# EAGLE schematic ultrasonic (EAGLE 4.15)
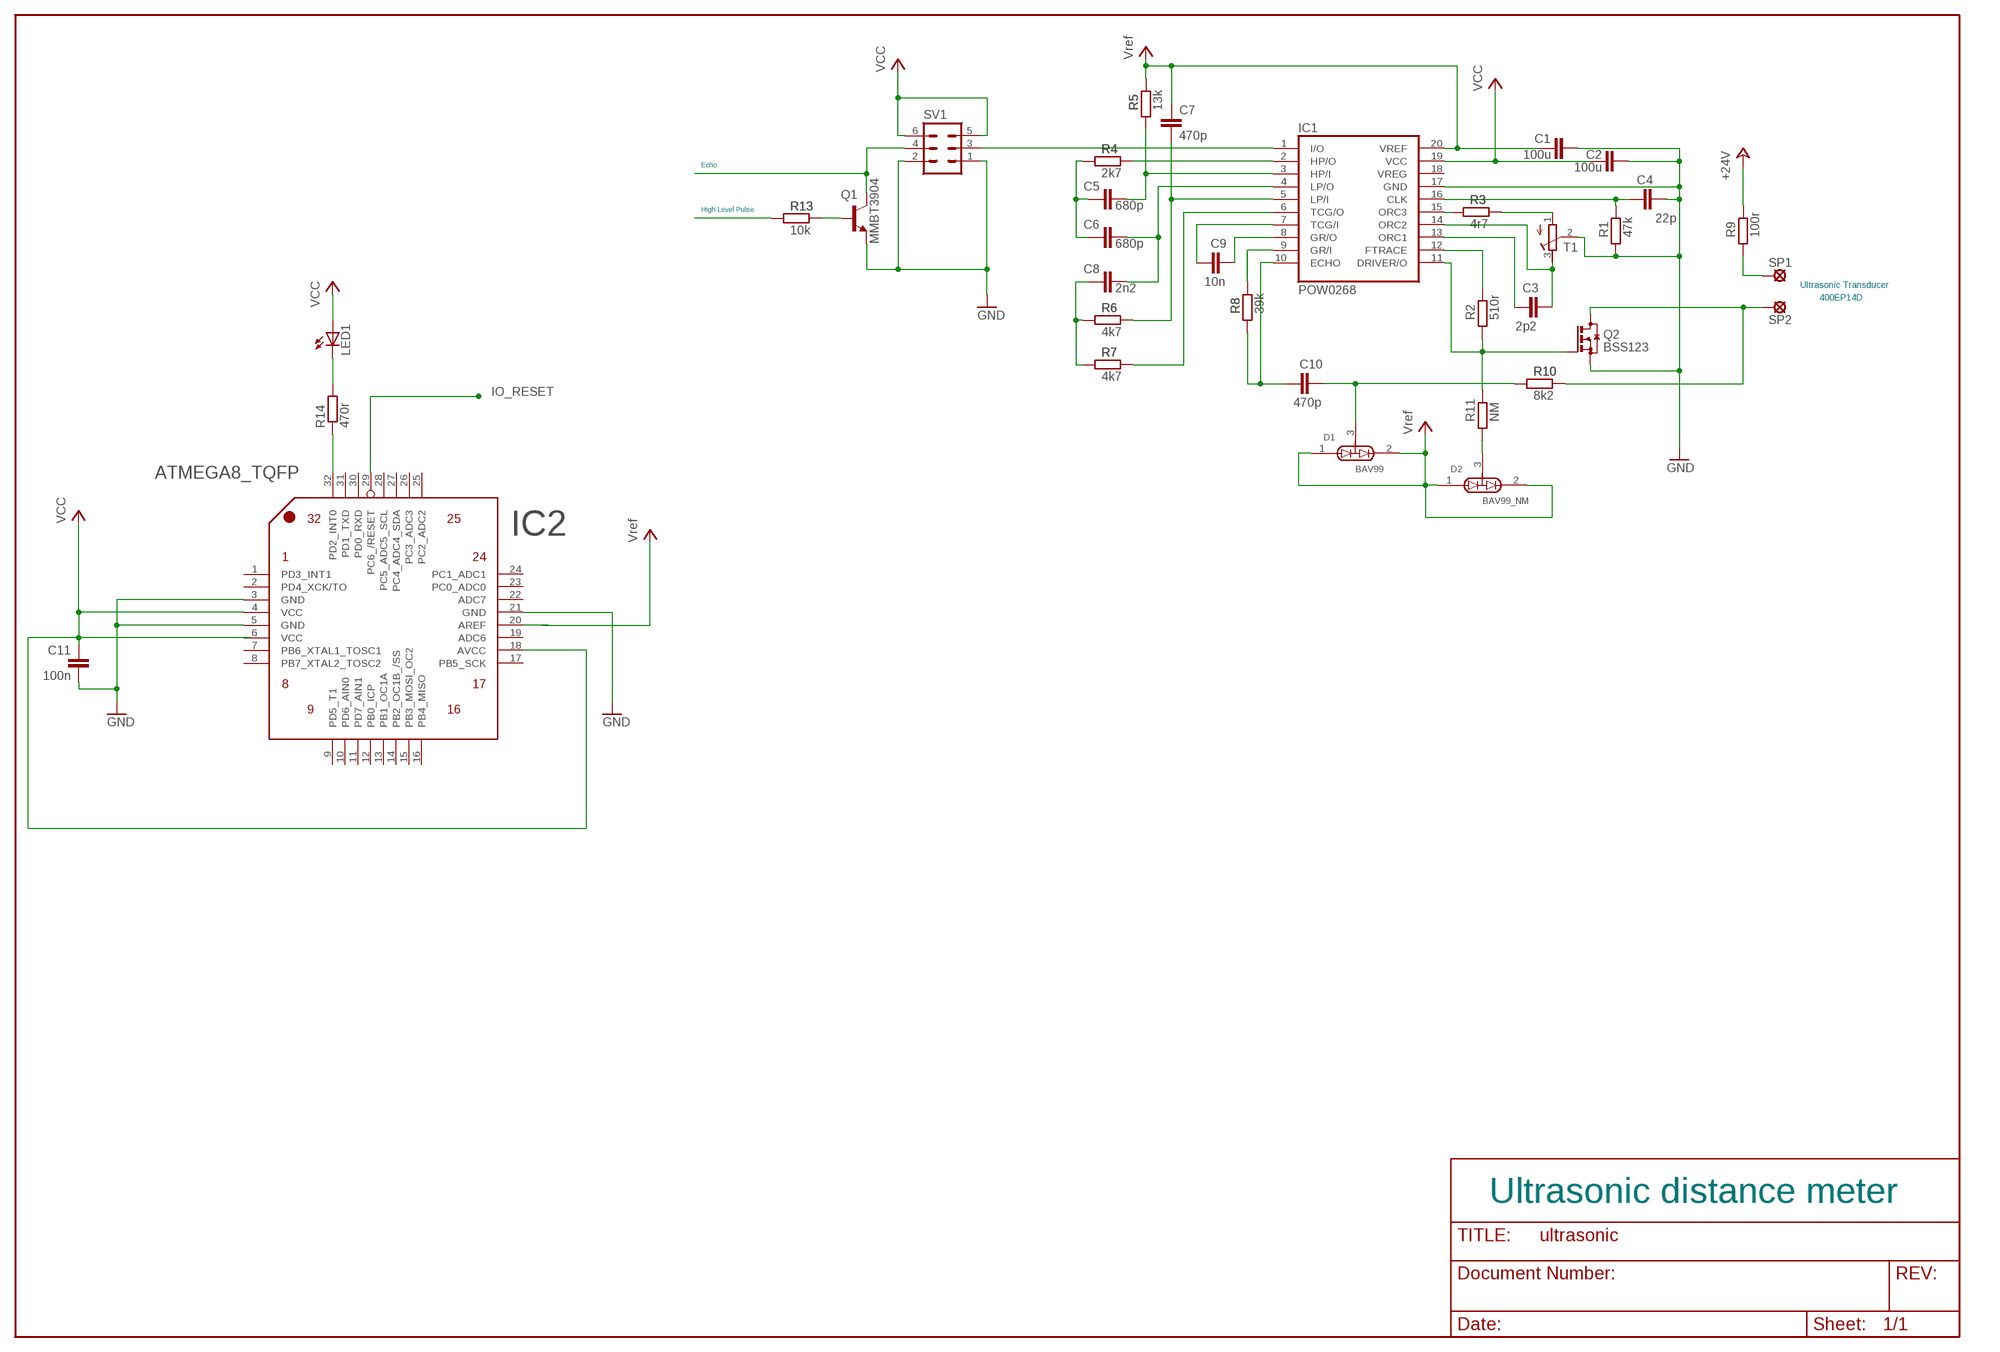
[diagram p0: schematic, sheet 1]

## Parts
C1  100u  C-EUC0805K  [C0805K]
C2  100u  C-EUC0805K  [C0805K]
C3  2p2  C-EUC0805K  [C0805K]
C4  22p  C-EUC0805K  [C0805K]
C5  680p  C-EUC0805K  [C0805K]
C6  680p  C-EUC0805K  [C0805K]
C7  470p  C-EUC0805K  [C0805K]
C8  2n2  C-EUC0805K  [C0805K]
C9  10n  C-EUC0805K  [C0805K]
C10  470p  C-EUC0805K  [C0805K]
C11  100n  C-EUC0805K  [C0805K]
D1  BAV99  [SOT23]
D2  BAV99_NM  BAV99  [SOT23]
IC1  POW0268  [SSOP20BU]
IC2  ATMEGA8_TQFP  [TQFP-32]
LED1  LEDCHIPLED_1206  [CHIPLED_1206]
Q1  MMBT3904  MMBT3904LT1-NPN-SOT23-BEC  [SOT23-BEC]
Q2  BSS123  [SOT23]
R1  47k  R-EU_R0805W  [R0805W]
R2  510r  R-EU_R0805W  [R0805W]
R3  4r7  R-EU_R0805W  [R0805W]
R4  2k7  R-EU_R0805W  [R0805W]
R5  13k  R-EU_R0805W  [R0805W]
R6  4k7  R-EU_R0805W  [R0805W]
R7  4k7  R-EU_R0805W  [R0805W]
R8  39k  R-EU_R0805W  [R0805W]
R9  100r  R-EU_R0805W  [R0805W]
R10  8k2  R-EU_R0805W  [R0805W]
R11  NM  R-EU_R0805W  [R0805W]
R13  10k  R-EU_R0805W  [R0805W]
R14  470r  R-EU_R0805W  [R0805W]
SP1  LSP10  [LSP10]
SP2  LSP10  [LSP10]
SV1  MA03-2  [MA03-2]
T1  R-TRIMM64W  [RTRIM64W]

## Nets
0V: C11.1 Q1.E SV1.1 SV1.2 ; supply symbol labelled GND
+3V3: LED1.A ; supply symbol labelled VCC
+24V: R9.2
GND: C1.2 C2.2 C4.1 IC1.17(GND) Q2.2(S) R1.1 T1.2(S)
IO_RESET: IC2.29(PC6_/RESET)
N$1: IC1.15(ORC3) R3.1
N$2: R3.2 T1.1(E)
N$3: C3.2 IC1.13(ORC1)
N$4: C4.2 IC1.16(CLK) R1.2
N$5: IC1.12(FTRACE) R2.2
N$6: D2.3 R11.1
N$7: IC1.11(DRIVER/O) Q2.1(G) R2.1 R11.2
N$8: Q2.3(D) R10.2 SP2.MP
N$9: IC1.1(I/O) SV1.3
N$10: IC1.2(HP/O) R4.2
N$11: C5.1 IC1.3(HP/I) R5.1
N$12: C7.1 IC1.5(LP/I) R6.2
N$13: C9.2 IC1.7(TCG/I)
N$14: C6.1 C8.1 IC1.4(LP/O)
N$15: C8.2 R6.1 R7.1
N$16: C5.2 C6.2 R4.1
N$17: IC1.6(TCG/O) R7.2
N$18: C9.1 IC1.8(GR/O)
N$19: IC1.9(GR/I) R8.2
N$20: C10.2 IC1.10(ECHO) R8.1
N$21: R9.1 SP1.MP
N$22: C10.1 D1.3 R10.1
N$23: C3.1 IC1.14(ORC2) T1.3(A)
N$24: Q1.B R13.2
N$25: R13.1
N$26: Q1.C SV1.4
N$28: LED1.C R14.2
N$29: R14.1
VCC: C1.1 C2.1 C7.2 C11.2 D1.1 D1.2 D2.1 D2.2 IC1.19(VCC) IC1.20(VREF) IC2.18(AVCC) IC2.20(AREF) R5.2 SV1.5 SV1.6 ; supply symbol labelled Vref
Unconnected: IC1.18(VREG) IC2.1(PD3_INT1) IC2.2(PD4_XCK/TO) IC2.7(PB6_XTAL1_TOSC1) IC2.8(PB7_XTAL2_TOSC2) IC2.9(PD5_T1) IC2.10(PD6_AIN0) IC2.11(PD7_AIN1) IC2.12(PB0_ICP) IC2.13(PB1_OC1A) IC2.14(PB2_OC1B_/SS) IC2.15(PB3_MOSI_OC2) IC2.16(PB4_MISO) IC2.17(PB5_SCK) IC2.22(ADC7) IC2.23(PC0_ADC0) IC2.24(PC1_ADC1) IC2.25(PC2_ADC2) IC2.26(PC3_ADC3) IC2.27(PC4_ADC4_SDA) IC2.28(PC5_ADC5_SCL) IC2.30(PD0_RXD) IC2.31(PD1_TXD) IC2.32(PD2_INT0)

## Notes on the sheet
- Echo
- High Level Pulse
- Ultrasonic Transducer
- 400EP14D
- Ultrasonic distance meter

## Power pins joined to a net without a drawn wire
ADC6: IC2.19(ADC6)
GND: IC2.3(GND) IC2.5(GND) IC2.21(GND)
VCC: IC2.4(VCC) IC2.6(VCC)

## Library data of the parts
C1-C11 = rcl:C-EU: CAPACITOR, European symbol
D1 D2 = lbm:BAV99
IC1 = lbm:POW0268
IC2 = atmel_prototype_header:ATMEGA8: IC AVR MCU 8K LV 8MHZ IND 32TQFP , Atmel Part number ATMEGA8L-8AI
LED1 = led:LED: LED OSRAM: - CHIPLED LG R971, LG N971, LY N971, LG Q971, LY Q971, LO R971, LY R971 LH N974, LH R974 LS Q976, LO Q976, LY Q976 LO Q996 - Hyper CHIPLED LW Q18S LB Q993, LB Q99A, LB R99A - SideLED LS A670, LO A670, LY A670, LG A670, LP A670 LB A673, LV A673, LT A673, LW A673 LH A674 LY A675 LS A676, LA A676, LO A676, LY A676, LW A676 LS A679, LY A679, LG A679 - Hyper Micro SIDELED® LS Y876, LA Y876, LO Y876, LY Y876 LT Y87S - SmartLED LW L88C, LW L88S LB L89C, LB L89S, LG L890 LS L89K, LO L89K, LY L89K LS L896, LA L896, LO L896, LY L896 - TOPLED LS T670, LO T670, LY T670, LG T670, LP T670 LSG T670, LSP T670, LSY T670, LOP T670, LYG T670 LG T671, LOG T671, LSG T671 LB T673, LV T673, LT T673, LW T673 LH T674 LS T676, LA T676, LO T676, LY T676, LB T676, LH T676, LSB T676, LW T676 LB T67C, LV T67C, LT T67C, LS T67K, LO T67K, LY T67K, LW E67C LS E67B, LA E67B, LO E67B, LY E67B, LB E67C, LV E67C, LT E67C LW T67C LS T679, LY T679, LG T679 LS T770, LO T770, LY T770, LG T770, LP T770 LB T773, LV T773, LT T773, LW T773 LH T774 LS E675, LA E675, LY E675, LS T675 LS T776, LA T776, LO T776, LY T776, LB T776 LHGB T686 LT T68C, LB T68C - Hyper Mini TOPLED® LB M676 - Mini TOPLED Santana® LG M470 LS M47K, LO M47K, LY M47K Source: http://www.osram.convergy.de/
Q1 = transistor:*-NPN-: NPN Transistror
Q2 = transistor-small-signal:BSS123: N-CHANNEL MOS FET
R1-R11 R13 R14 = rcl:R-EU_: RESISTOR, European symbol
SP1 SP2 = solpad:LSP10: SOLDER PAD drill 1.0 mm, distributor Buerklin, 12H555
SV1 = con-lstb:MA03-2: PIN HEADER
T1 = rcl:R-TRIMM: Trimm resistor

## Net classes
1 power: width 0.813 mm, drill 0.203 mm